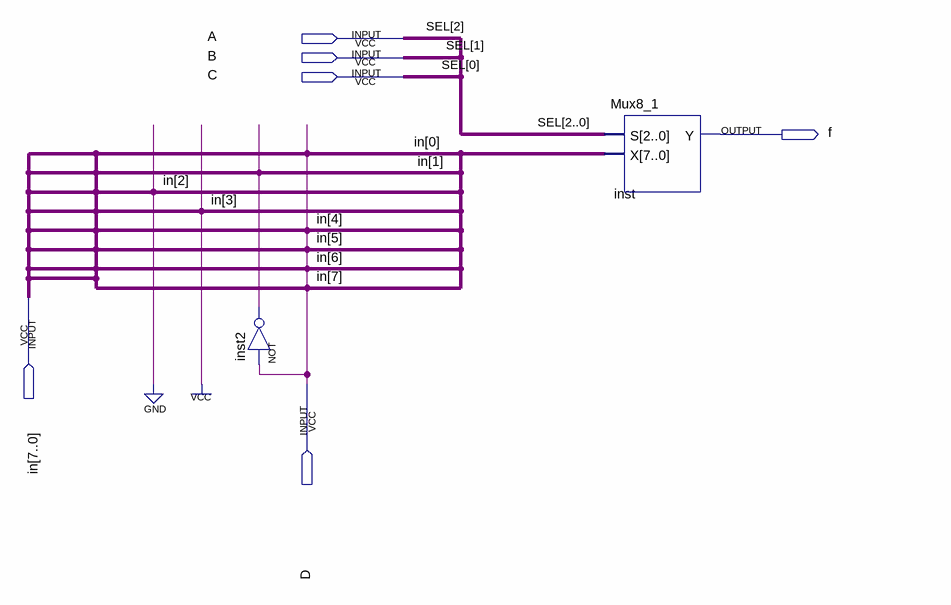
[diagram p0: schematic sheet]
// Quartus schematic Mux8_1_function.bdf as structural Verilog: 2 symbols, 6 pins
module Mux8_1_function (
  input  A,
  input  B,
  input  C,
  input  [7:0] in,
  input  D,
  output f
);

  not inst2 (in[1], D);
  Mux8_1 inst (.S({A, B, C}), .X({8{in[0]}}), .Y(f));
  // also tied to GND on the sheet: in[2]
  // also tied to VCC on the sheet: in[3]

  // Other names for the same wires on the sheet: SEL[2:0] = {A, B, C}
endmodule
